# EasyEDA Pro project ProPrj_STM32F103ZET6_2025-04-15.epro, board PCB1
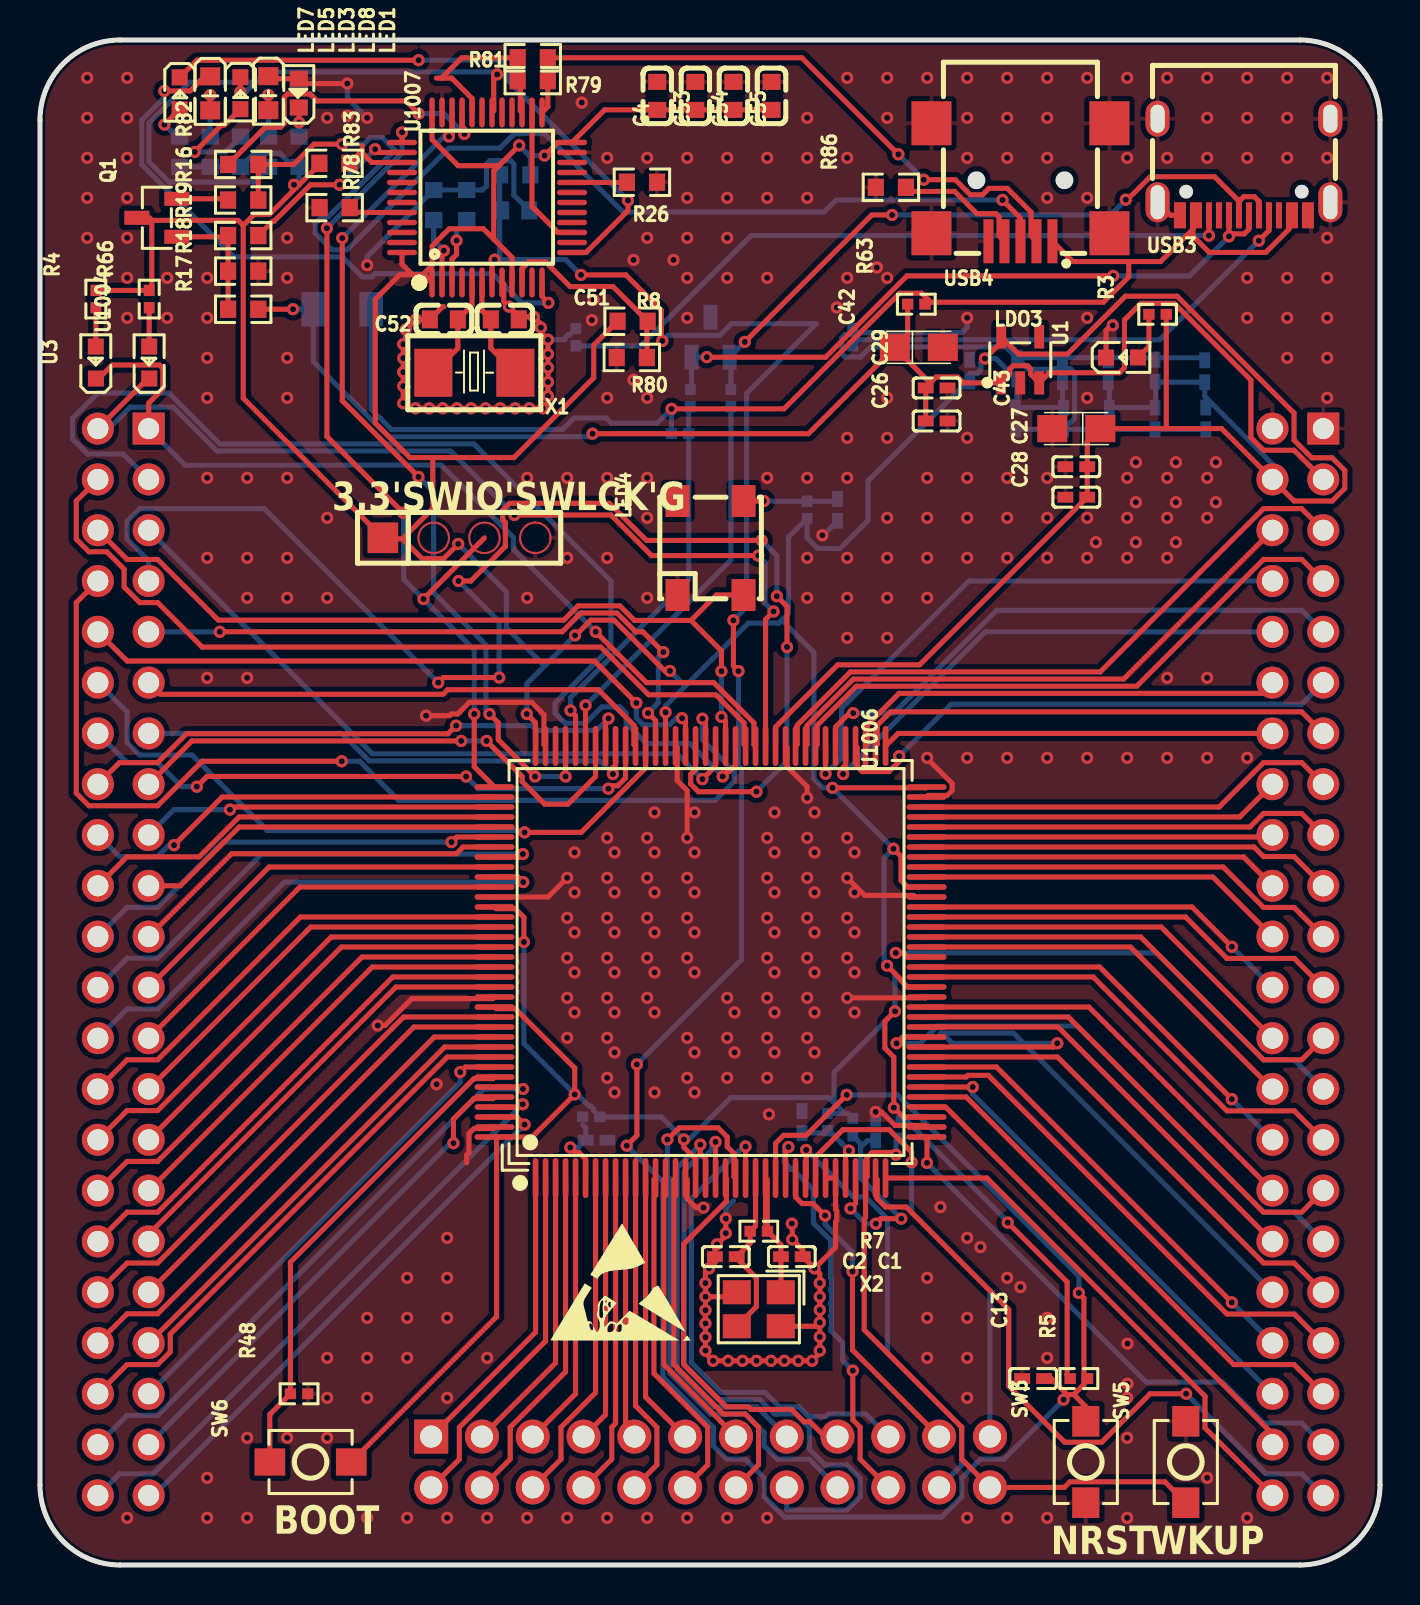
[diagram p4: board, top side]
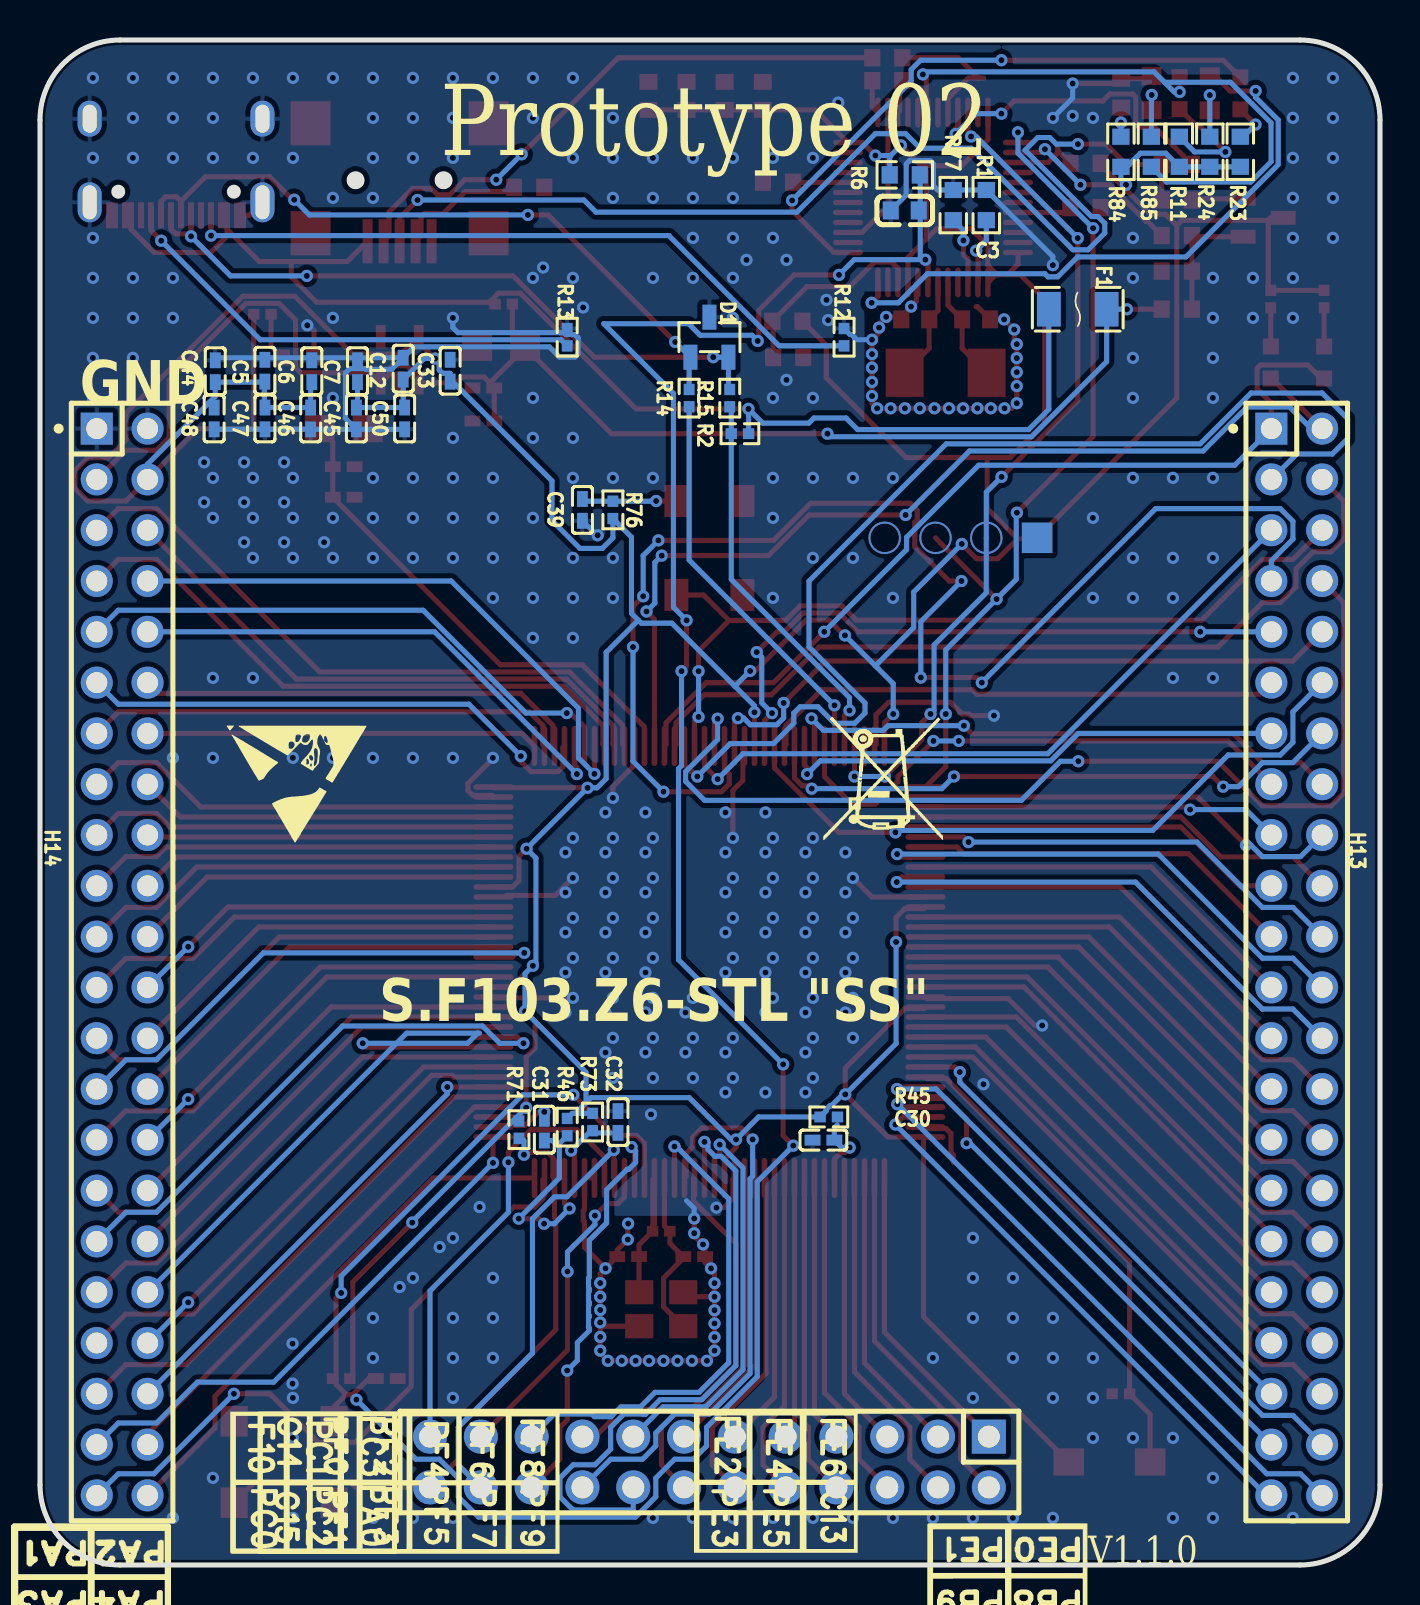
[diagram p5: board, bottom side, seen from below]

Outline 67 x 76.25 mm; copper layers: Top Layer, Bottom Layer. Coordinates in mm from the lower left corner of the outline.
Outline path: 0,72.25 0,4 arc(1.17,1.17) 4,0 63,0 arc(65.83,1.17) 67,4 67,72.25 arc(65.83,75.08) 63,76.25 4,76.25 arc(1.17,75.08) 0,72.25
Stack: Top Layer 0.035mm / Dielectric1 1.51mm FR4 er 4.5 / Bottom Layer 0.035mm

## Design rules (mm)
template: JLCPCB Capability(Two Layers Board)
spacing copperThickness1oz (default): track to track 0.102, other pairs 0.152 to 0.3
spacing copperThickness2oz: track to track 0.203, other pairs 0.152 to 0.3
track width copperThickness1oz (default): min 0.127, default 0.254, max 2.54
track width copperThickness2oz: min 0.203, default 0.254, max 2.54
differential pair differentialPair (default): width min 0.127, default 0.254, max 2.54; gap min 0.152, default 0.152
via viaSize (default): diameter min 0.5, default 0.61, max 10; hole min 0.3, default 0.305, max 6.3

## Placement (name value [footprint] x y rotation side)
C1  22pF  [C0402]  37.59 15.42 0 top
C2  22pF  [C0402]  34.29 15.42 0 top
C3  100nF  [C0603]  23.76 67.73 0 bottom
C4  100nF  [C0603]  30.86 73.46 90 top
C5  100nF  [C0402]  55.76 59.72 90 bottom
C6  100nF  [C0402]  53.41 59.69 90 bottom
C7  100nF  [C0402]  51.13 59.69 90 bottom
C12  100nF  [C0402]  48.84 59.82 90 bottom
C13  100nF  [C0402]  49.66 9.32 180 top
C26  100nF  [C0402]  44.83 57.2 0 top
C27  100nF  [C0402]  51.82 54.92 180 top
C28  100nF  [C0402]  51.82 53.39 180 top
C29  100nF  [C0402]  44.83 58.85 0 top
C30  100nF  [C0402]  27.83 21.25 0 bottom
C31  100nF  [C0402]  41.78 21.77 90 bottom
C32  100nF  [C0402]  38.1 22.15 90 bottom
C33  100nF  [C0402]  46.49 59.72 90 bottom
C39  100nF  [C0402]  39.88 52.76 270 bottom
C42  22uF  [CASE-A_3216]  43.94 60.88 0 top
C43  22uF  [CASE-A_3216]  51.82 56.82 180 top
C44  100nF  [C0402]  58.24 59.69 90 bottom
C45  100nF  [C0402]  51.18 57.33 270 bottom
C46  100nF  [C0402]  53.47 57.33 270 bottom
C47  100nF  [C0402]  55.75 57.33 270 bottom
C48  100nF  [C0402]  58.29 57.33 270 bottom
C50  100nF  [C0402]  48.77 57.33 270 bottom
C51  22pF  [C0603]  23.24 62.28 180 top
C52  22pF  [C0603]  20.19 62.28 0 top
C53  100nF  [C0603]  32.77 73.46 90 top
C54  100nF  [C0603]  34.67 73.46 90 top
C55  100nF  [C0603]  36.58 73.46 90 top
D1  ESD5302F-3/TR  [SOT-23-3_L2.9-W1.3-P1.90-LS2.4-BR]  33.53 61.39 270 bottom
F1  TLC-NSMD100  [F1206]  15.11 62.79 180 bottom
H12  PZ254V-12-24P  [HDR-TH_24P-P2.54-V-M-R2-C12-S2.54]  33.53 5.15 0 bottom
H13  X6521WV-2x22H-C60D30  [HDR-TH_44P-2.54-V-M-R2-C22-S2.54]  4.16 30.15 270 bottom
H14  X6521WV-2x22H-C60D30  [HDR-TH_44P-2.54-V-M-R2-C22-S2.54]  62.89 30.15 270 bottom
LDO3  ME6211C33M5G-N  [SOT-23-5_L3.0-W1.7-P0.95-LS2.8-BL]  49.01 60.26 0 top
LED1  19-217/BHC-ZL1M2RY/3T  [LED0603-FD_BLUE]  12.94 73.59 90 top
LED3  KT-0603R  [LED0603-RD]  10.02 73.59 270 top
LED4  WS2812E-V5  [LED-SMD_4P-L5.0-W5.0-LS5.4-TL-1]  33.53 50.85 270 top
LED5  NCD0603G1  [LED0603-RD_1]  8.51 73.58 270 top
LED7  KT-0603R  [LED0603-RD]  6.98 73.58 270 top
LED8  NCD0603G1  [LED0603-RD_1]  11.42 73.59 270 top
Q1  M8050  [SOT-23-3_L2.9-W1.3-P1.90-LS2.4-BR]  5.84 67.36 0 top
R1  10kΩ  [R0603]  19.69 68 270 bottom
R2  10kΩ  [R0402]  32 56.57 0 bottom
R3  10kΩ  [R0402]  55.88 62.54 0 top
R4  10kΩ  [R0402]  2.79 63.3 90 top
R5  10kΩ  [R0402]  51.94 9.32 180 top
R6  100kΩ  [R0603]  23.76 69.51 0 bottom
R7  10kΩ  [R0402]  35.94 16.69 180 top
R8  4.7kΩ  [R0603]  29.59 60.38 0 top
R11  1kΩ  [R0603]  10.03 70.66 90 bottom
R12  10kΩ  [R0402]  26.8 61.39 90 bottom
R13  10kΩ  [R0402]  40.64 61.39 90 bottom
R14  10kΩ  [R0402]  34.54 58.34 270 bottom
R15  10kΩ  [R0402]  32.51 58.34 270 bottom
R16  1.5kΩ  [R0603]  10.16 68.25 180 top
R17  10kΩ  [R0603]  10.16 62.79 0 top
R18  36kΩ  [R0603]  10.16 64.69 180 top
R19  100Ω  [R0603]  10.16 66.47 180 top
R23  1kΩ  [R0603]  6.98 70.66 90 bottom
R24  1kΩ  [R0603]  8.51 70.66 90 bottom
R26  10kΩ  [R0603]  30.1 69.14 180 top
R45  10kΩ  [R0402]  27.56 22.4 0 bottom
R46  10kΩ  [R0402]  40.64 21.9 270 bottom
R48  10kΩ  [R0402]  12.95 8.56 180 top
R63  10kΩ  [R0402]  43.82 63.04 0 top
R66  10kΩ  [R0402]  5.46 63.3 90 top
R71  10kΩ  [R0402]  43.05 21.77 90 bottom
R73  10kΩ  [R0402]  39.37 22.15 270 bottom
R76  10kΩ  [R0402]  38.35 52.76 90 bottom
R77  10kΩ  [R0603]  21.34 68 270 bottom
R78  10kΩ  [R0603]  14.73 67.87 180 top
R79  100Ω  [R0603]  24.64 74.22 0 top
R80  4.7kΩ  [R0603]  29.63 62.19 180 top
R81  10Ω  [R0603]  24.64 75.36 180 top
R82  10Ω  [R0603]  10.16 70.03 180 top
R83  4.7kΩ  [R0603]  14.72 70.09 0 top
R84  1kΩ  [R0603]  12.95 70.66 90 bottom
R85  1kΩ  [R0603]  11.43 70.66 90 bottom
R86  100kΩ  [R0603]  42.55 68.89 0 top
SW3  TS342A2P-WZ  [SW-SMD_L4.0-W2.9-LS5.0]  52.29 5.15 90 top
SW5  TS342A2P-WZ  [SW-SMD_L4.0-W2.9-LS5.0]  57.29 5.15 270 top
SW6  TS342A2P-WZ  [SW-SMD_L4.0-W2.9-LS5.0]  13.53 5.15 0 top
U1  -  [LED0603-RD_GREEN]  54.1 60.38 0 top
U2  -  [HDR4P]  15.88 50.09 0 top
U3  -  [LED0603-RD_GREEN]  2.79 60.12 90 top
U1004  -  [LED0603-RD_GREEN]  5.46 60.12 90 top
U1006  STM32F103ZET6  [LQFP-144_L20.0-W20.0-P0.50-LS22.0-BL]  33.53 30.15 0 top
U1007  STM32F103CBT6  [LQFP-48_L7.0-W7.0-P0.50-LS9.0-BL]  22.35 68.38 0 top
USB3  KH-TYPE-C-16P  [USB-C-SMD_KH-TYPE-C-16P]  60.2 69.9 180 top
USB4  MINI 5PTP  [MINI-USB-SMD_MINI-5PTP]  49.02 69.14 180 top
X1  8MHz  [OSC-SMD_L5.0-W3.2]  21.72 59.61 180 top
X2  8MHz  [CRYSTAL-SMD_4P-L3.2-W2.5-BL]  35.94 12.79 180 top

## Footprints (pads in the part's own frame, mm; a bottom-side part is the same pattern mirrored in y, then rotated)
C0402
  rect 0.79x0.54 smd: 1(-0.545,0) 2(0.545,0)
C0603
  rect 0.8x0.9 smd: 1(-0.7,0) 2(0.7,0)
CASE-A_3216
  rect 1.5x1.359 smd: 1(-1.2,0) 2(1.2,0)
CRYSTAL-SMD_4P-L3.2-W2.5-BL
  rect 1.4x1.2 smd: 1(-1.1,-0.85) 2(1.1,-0.85) 3(1.1,0.85) 4(-1.1,0.85)
F1206
  rect 1.19x1.728 smd: 1(-1.445,0) 2(1.445,0)
HDR4P
  custom 1.524x1.524 hole 0.914: 1(1.27,1.27) 2(3.81,1.27) 3(6.35,1.27) 4(8.89,1.27)
HDR-TH_24P-P2.54-V-M-R2-C12-S2.54
  rect 1.7x1.7 hole 1.1: 1(-13.97,-1.27)
  round 1.7 hole 1.1: 2(-13.97,1.27) 3(-11.43,-1.27) 4(-11.43,1.27) 5(-8.89,-1.27) 6(-8.89,1.27) 7(-6.35,-1.27) 8(-6.35,1.27) 9(-3.81,-1.27) 10(-3.81,1.27) 11(-1.27,-1.27) 12(-1.27,1.27) 13(1.27,-1.27) 14(1.27,1.27) 15(3.81,-1.27) 16(3.81,1.27) 17(6.35,-1.27) 18(6.35,1.27) 19(8.89,-1.27) 20(8.89,1.27) 21(11.43,-1.27) 22(11.43,1.27) 23(13.97,-1.27) 24(13.97,1.27)
HDR-TH_44P-2.54-V-M-R2-C22-S2.54
  rect 1.6x1.6 hole 1.05: 1(-26.67,-1.27)
  round 1.6 hole 1.05: 2(-26.67,1.27) 3(-24.13,-1.27) 4(-24.13,1.27) 5(-21.59,-1.27) 6(-21.59,1.27) 7(-19.05,-1.27) 8(-19.05,1.27) 9(-16.51,-1.27) 10(-16.51,1.27) 11(-13.97,-1.27) 12(-13.97,1.27) 13(-11.43,-1.27) 14(-11.43,1.27) 15(-8.89,-1.27) 16(-8.89,1.27) 17(-6.35,-1.27) 18(-6.35,1.27) 19(-3.81,-1.27) 20(-3.81,1.27) 21(-1.27,-1.27) 22(-1.27,1.27) 23(1.27,-1.27) 24(1.27,1.27) 25(3.81,-1.27) 26(3.81,1.27) 27(6.35,-1.27) 28(6.35,1.27) 29(8.89,-1.27) 30(8.89,1.27) 31(11.43,-1.27) 32(11.43,1.27) 33(13.97,-1.27) 34(13.97,1.27) 35(16.51,-1.27) 36(16.51,1.27) 37(19.05,-1.27) 38(19.05,1.27) 39(21.59,-1.27) 40(21.59,1.27) 41(24.13,-1.27) 42(24.13,1.27) 43(26.67,-1.27) 44(26.67,1.27)
LED0603-FD_BLUE
  rect 0.8x0.9 smd: 1(-0.72,0) 2(0.72,0)
LED0603-RD
  rect 0.8x0.8 smd: 1(-0.799,0) 2(0.799,0)
LED0603-RD_1
  rect 0.9x1 smd: 1(-0.85,0) 2(0.85,0)
LED0603-RD_GREEN
  rect 0.8x0.8 smd: 1(-0.8,-0.003) 2(0.8,0.003)
LED-SMD_4P-L5.0-W5.0-LS5.4-TL-1
  rect 1.6x1.2 smd: 1(-2.35,1.65) 2(-2.35,-1.65) 3(2.35,-1.65) 4(2.35,1.65)
LQFP-48_L7.0-W7.0-P0.50-LS9.0-BL
  oval 0.27x1.5 smd: 1(-2.75,-4.25) 2(-2.25,-4.25) 3(-1.75,-4.25) 4(-1.25,-4.25) 5(-0.75,-4.25) 6(-0.25,-4.25) 7(0.25,-4.25) 8(0.75,-4.25) 9(1.25,-4.25) 10(1.75,-4.25) 11(2.25,-4.25) 12(2.75,-4.25) 25(2.75,4.25) 26(2.25,4.25) 27(1.75,4.25) 28(1.25,4.25) 29(0.75,4.25) 30(0.25,4.25) 31(-0.25,4.25) 32(-0.75,4.25) 33(-1.25,4.25) 34(-1.75,4.25) 35(-2.25,4.25) 36(-2.75,4.25)
  oval 1.5x0.27 smd: 13(4.25,-2.75) 14(4.25,-2.25) 15(4.25,-1.75) 16(4.25,-1.25) 17(4.25,-0.75) 18(4.25,-0.25) 19(4.25,0.25) 20(4.25,0.75) 21(4.25,1.25) 22(4.25,1.75) 23(4.25,2.25) 24(4.25,2.75) 37(-4.25,2.75) 38(-4.25,2.25) 39(-4.25,1.75) 40(-4.25,1.25) 41(-4.25,0.75) 42(-4.25,0.25) 43(-4.25,-0.25) 44(-4.25,-0.75) 45(-4.25,-1.25) 46(-4.25,-1.75) 47(-4.25,-2.25) 48(-4.25,-2.75)
LQFP-144_L20.0-W20.0-P0.50-LS22.0-BL
  oval 0.28x2 smd: 1(-8.75,-10.8) 2(-8.25,-10.8) 3(-7.75,-10.8) 4(-7.25,-10.8) 5(-6.75,-10.8) 6(-6.25,-10.8) 7(-5.75,-10.8) 8(-5.25,-10.8) 9(-4.75,-10.8) 10(-4.25,-10.8) 11(-3.75,-10.8) 12(-3.25,-10.8) 13(-2.75,-10.8) 14(-2.25,-10.8) 15(-1.75,-10.8) 16(-1.25,-10.8) 17(-0.75,-10.8) 18(-0.25,-10.8) 19(0.25,-10.8) 20(0.75,-10.8) 21(1.25,-10.8) 22(1.75,-10.8) 23(2.25,-10.8) 24(2.75,-10.8) 25(3.25,-10.8) 26(3.75,-10.8) 27(4.25,-10.8) 28(4.75,-10.8) 29(5.25,-10.8) 30(5.75,-10.8) 31(6.25,-10.8) 32(6.75,-10.8) 33(7.25,-10.8) 34(7.75,-10.8) 35(8.25,-10.8) 36(8.75,-10.8) 73(8.75,10.8) 74(8.25,10.8) 75(7.75,10.8) 76(7.25,10.8) 77(6.75,10.8) 78(6.25,10.8) 79(5.75,10.8) 80(5.25,10.8) 81(4.75,10.8) 82(4.25,10.8) 83(3.75,10.8) 84(3.25,10.8) 85(2.75,10.8) 86(2.25,10.8) 87(1.75,10.8) 88(1.25,10.8) 89(0.75,10.8) 90(0.25,10.8) 91(-0.25,10.8) 92(-0.75,10.8) 93(-1.25,10.8) 94(-1.75,10.8) 95(-2.25,10.8) 96(-2.75,10.8) 97(-3.25,10.8) 98(-3.75,10.8) 99(-4.25,10.8) 100(-4.75,10.8) 101(-5.25,10.8) 102(-5.75,10.8) 103(-6.25,10.8) 104(-6.75,10.8) 105(-7.25,10.8) 106(-7.75,10.8) 107(-8.25,10.8) 108(-8.75,10.8)
  oval 2x0.28 smd: 37(10.8,-8.75) 38(10.8,-8.25) 39(10.8,-7.75) 40(10.8,-7.25) 41(10.8,-6.75) 42(10.8,-6.25) 43(10.8,-5.75) 44(10.8,-5.25) 45(10.8,-4.75) 46(10.8,-4.25) 47(10.8,-3.75) 48(10.8,-3.25) 49(10.8,-2.75) 50(10.8,-2.25) 51(10.8,-1.75) 52(10.8,-1.25) 53(10.8,-0.75) 54(10.8,-0.25) 55(10.8,0.25) 56(10.8,0.75) 57(10.8,1.25) 58(10.8,1.75) 59(10.8,2.25) 60(10.8,2.75) 61(10.8,3.25) 62(10.8,3.75) 63(10.8,4.25) 64(10.8,4.75) 65(10.8,5.25) 66(10.8,5.75) 67(10.8,6.25) 68(10.8,6.75) 69(10.8,7.25) 70(10.8,7.75) 71(10.8,8.25) 72(10.8,8.75) 109(-10.8,8.75) 110(-10.8,8.25) 111(-10.8,7.75) 112(-10.8,7.25) 113(-10.8,6.75) 114(-10.8,6.25) 115(-10.8,5.75) 116(-10.8,5.25) 117(-10.8,4.75) 118(-10.8,4.25) 119(-10.8,3.75) 120(-10.8,3.25) 121(-10.8,2.75) 122(-10.8,2.25) 123(-10.8,1.75) 124(-10.8,1.25) 125(-10.8,0.75) 126(-10.8,0.25) 127(-10.8,-0.25) 128(-10.8,-0.75) 129(-10.8,-1.25) 130(-10.8,-1.75) 131(-10.8,-2.25) 132(-10.8,-2.75) 133(-10.8,-3.25) 134(-10.8,-3.75) 135(-10.8,-4.25) 136(-10.8,-4.75) 137(-10.8,-5.25) 138(-10.8,-5.75) 139(-10.8,-6.25) 140(-10.8,-6.75) 141(-10.8,-7.25) 142(-10.8,-7.75) 143(-10.8,-8.25) 144(-10.8,-8.75)
MINI-USB-SMD_MINI-5PTP
  rect 0.5x2.2 smd: 1(-1.6,2.95) 2(-0.8,2.95) 3(0,2.95) 4(0.8,2.95) 5(1.6,2.95)
  rect 2x2.2 smd: 6(-4.45,2.55) 7(4.45,2.55) 8(4.45,-2.95) 9(-4.45,-2.95)
OSC-SMD_L5.0-W3.2
  rect 1.9x2.4 smd: 1(-2.05,0) 2(2.05,0)
R0402
  rect 0.566x0.54 smd: 1(-0.433,0) 2(0.433,0)
R0603
  rect 0.806x0.864 smd: 1(-0.753,0) 2(0.753,0)
SOT-23-3_L2.9-W1.3-P1.90-LS2.4-BR
  rect 1.25x0.7 smd: 1(1,-0.95) 2(1,0.95) 3(-1,0)
SOT-23-5_L3.0-W1.7-P0.95-LS2.8-BL
  rect 0.49x1.157 smd: 1(-0.95,-1.153) 2(0,-1.153) 3(0.95,-1.153)
  rect 0.49x1.175 smd: 4(0.95,1.153) 5(-0.95,1.153)
SW-SMD_L4.0-W2.9-LS5.0
  rect 1.53x1.36 smd: 1(-2.035,0) 2(2.035,0)
USB-C-SMD_KH-TYPE-C-16P
  oval 1.2x2 hole 0.7x1.7: 1(-4.32,1.765) 2(4.32,1.765)
  oval 1.2x1.8 hole 0.7x1.4: 3(-4.32,-2.415) 4(4.32,-2.415)
  rect 0.3x1.3 smd: A1(-3.35,2.415) A4(-2.55,2.415) A5(-1.25,2.415) A6(-0.25,2.415) A7(0.25,2.415) A8(1.25,2.415) A9(2.55,2.415) A12(3.35,2.415) B1(3.05,2.415) B4(2.25,2.415) B5(1.75,2.415) B6(0.75,2.415) B7(-0.75,2.415) B8(-1.75,2.415) B9(-2.25,2.415) B12(-3.05,2.415)

## Nets
As in the schematic.

Pads without a net: LDO3 4; LED4 2; U1006 106; U1007 4 11 14 16 17 19 21 22 28 29 40 41 42 43 45 46; USB3 A8 B8

## Via types
v1: diameter 0.61, hole 0.305, Top Layer to Bottom Layer, 533 vias

## Routing (per net, layer and track width the routed paths; a pad name or vN(x,y) marks a point on that pad's centre or on a via; arc(x,y) is an arc through that point)
+3.3V: length 381.1
  Top Layer w0.254: 22.69,66.29 22.17,66.81 20.46,66.81 19.61,65.96 19.61,64.99 19.13,64.52 ; 22.69,66.29 22.69,69.71 22.94,69.97 ; 22.69,66.29 23.6,65.38 U1007.9 ; 19.13,64.52 19.21,64.52 U1007.1 ; 19.13,64.52 18.63,64.52 ; 22.83,21.4 24.61,21.4 v1(26.74,23.53) 26.74,24.84 23.76,27.82 22.81,27.82 U1006.131 ; 22.83,21.4 U1006.144 ; 22.83,21.4 22.83,12.41 SW6.2 ; R80.2 27.69,61 27.69,59.36 23.7,55.37 19.64,55.37 ; C55.1 C54.1 C53.1 C4.1 28.23,72.76 U1007.24 25.88,71.13 v1(25.23,70.47) ; U1006.108 24.78,42.11 v1(24.34,42.55) ; v1(26.75,46.48) 26.78,46.48 27.54,47.24 28.7,47.24 31.24,44.7 v1(31.5,44.7) ; v1(42.36,29.96) 43.05,29.27 43.05,29.23 43.38,28.9 U1006.52 ; v1(39.62,38.86) 44.29,38.86 U1006.72 ; 12.95,69.01 v1(12.7,69.01) ; 12.95,69.01 11.48,67.54 10.72,67.54 10.16,66.98 ; 12.95,69.01 13.97,70.03 R83.1 ; 18.63,64.52 18.1,65.04 U1007.48 ; 18.63,64.52 17.99,64.52 16.76,63.29 16.76,57.11 18.5,55.37 19.64,55.37 ; 5.59,67.23 5.46,67.36 Q1.3 ; 5.59,67.23 9.91,67.23 10.16,66.98 ; 5.59,67.23 5.59,63.86 R66.2 R4.2 ; U1006.121 22.81,32.82 23.76,32.82 24.2,32.38 v1(24.2,31.15) ; R3.2 56.31,56.84 56.29,56.82 ; 22.94,69.97 v1(23.96,70.98) ; 22.94,69.97 20.91,69.97 19.6,71.28 U1007.36 ; 18.12,51.31 19.64,52.83 19.64,55.37 ; 18.12,51.31 19.11,50.32 20.18,50.32 v1(20.91,51.05) ; 18.12,51.31 17.2,51.31 10.16,58.34 10.16,66.98 ; U1006.84 36.78,41.9 39.88,45.01 43.98,45.01 C28.1 C27.1 52.36,56.17 C43.1 56.29,56.82 ; 56.29,56.82 59.08,56.82 H14.4 62.7,53.2 64.61,53.2 65.24,53.83 65.24,54.73 64.61,55.36 63.59,55.36 62.7,56.24 62.7,57.6 56.86,63.44 54.27,63.44 51.37,60.55 48.93,60.55 LDO3.5 48.06,61.14 v1(47.24,60.32) ; v1(42.75,27.69) 42.24,27.18 42.24,25.84 42.69,25.4 v1(42.69,22.87) 43.16,22.4 U1006.39 ; v1(32.2,21.27) 32.2,20.88 32.78,20.3 U1006.17 ; U1006.95 v1(31.28,42.64) ; v1(42.67,35.81) 43.05,35.44 43.05,34.23 43.38,33.9 U1006.62 ; R5.2 51.36,9.47 51.36,14.15 v1(48.39,17.12)
  Bottom Layer w0.254: v1(42.69,22.87) 48.39,17.17 v1(48.39,17.12) ; v1(12.7,69.01) 12.95,69.27 R84.1 12.66,69.91 11.98,70.59 10.72,70.59 R11.1 R24.1 R23.1 ; 55.78,59.15 C44.1 58.24,58.43 58.58,58.09 ; 55.78,59.15 C5.1 ; 55.78,59.15 55.78,57.9 C47.1 C46.1 53.47,59.09 C6.1 ; 32.26,43.94 35.41,47.09 36.93,47.09 37.08,47.24 ; 32.26,43.94 v1(31.5,44.7) ; 32.26,43.94 31.28,42.96 v1(31.28,42.64) ; 37.08,47.24 38.69,45.63 38.69,39.31 39.15,38.86 v1(39.62,38.86) v1(42.67,35.81) 42.2,35.35 42.2,30.11 v1(42.36,29.96) 42.75,29.57 v1(42.75,27.69) 39.7,24.64 39.7,23.11 ; 37.08,47.24 37.43,47.59 37.43,51.4 R76.1 38.35,51.36 38.88,50.83 40.01,50.83 41.4,52.23 41.4,54.21 46.24,59.04 ; H14.4 61.62,55.04 58.58,58.09 ; 25.23,44.96 23.32,46.87 23.32,48.65 v1(20.91,51.05) ; 25.23,44.96 v1(26.75,46.48) ; 25.23,44.96 24.34,44.07 v1(24.34,42.55) ; R73.1 40.23,22.58 ; 40.23,22.58 39.7,23.11 ; 40.23,22.58 40.39,22.58 R46.1 ; v1(24.2,31.15) 24.2,26.07 v1(26.74,23.53) 26.86,23.53 27.44,22.95 27.52,22.95 27.69,22.79 27.69,22.71 R45.2 31.07,22.4 v1(32.2,21.27) 32.44,21.27 34.54,23.37 39.45,23.37 39.7,23.11 ; R6.2 24.52,70.43 24.47,70.47 ; 24.47,70.47 v1(25.23,70.47) ; 24.47,70.47 v1(23.96,70.98) ; C7.1 51.13,57.93 C45.1 C50.1 48.84,57.94 48.84,59.27 47.79,60.32 v1(47.24,60.32) 47.04,60.12 47.04,59.75 46.88,59.59 46.51,59.59 46.49,59.57 C33.1 ; 58.58,58.09 58.36,57.87 C48.1
+5V: length 74.1
  Top Layer w0.254: 42.98,60.89 42.98,60.63 44.51,59.11 ; 42.98,60.89 C42.1 38.42,56.57 v1(27.63,56.57) ; 42.98,60.89 43.38,61.29 R63.1 ; v1(12.65,62.79) R17.2 ; C26.1 C29.1 44.51,59.11 ; 44.51,59.11 44.8,59.4 45.89,59.4 46.18,59.11 48.06,59.11 48.49,59.53 48.49,59.8 48.65,59.96 49.37,59.96 49.54,59.8 49.54,59.53 49.96,59.11 50.45,59.59 50.45,59.61 53.97,59.61 54.22,59.86 54.22,62.26 55.05,63.08 56.71,63.08 60.54,59.25 60.54,56.37 61.18,55.74 62.7,55.74 H14.3
  Bottom Layer w0.254: v1(12.65,62.79) F1.2 13.67,60.17 17.42,56.41 27.48,56.41 v1(27.63,56.57)
GND: length 164.8
  Top Layer w0.254: U1006.130 22.65,28.32 18.59,28.32 17.25,26.98 v1(16.89,26.98) ; v1(41.78,22.66) 42.07,22.66 42.75,21.98 44.25,21.98 U1006.38 ; U1006.107 25.2,41.03 25.2,42.52 24.58,43.13 21.47,43.13 20.89,42.55 20.56,42.55 20.48,42.47 v1(19.3,42.47) ; U1006.83 37.36,40.87 37.36,39.92 38.36,38.92 v1(38.36,38.36) ; v1(44.36,40.36) 44.36,40.32 45.61,39.07 45.61,38.73 45.36,38.48 44.41,38.48 U1006.71 ; U1.1 53.3,61.73 53.59,62.03 ; v1(40.36,28.36) 44.29,28.36 U1006.51 ; 43.69,33.48 41.24,33.48 v1(40.36,34.36) ; U1007.8 23.19,64.04 23.19,63.18 v1(23.45,62.92) 23.94,62.43 C51.1 24.07,62.41 v1(24.69,62.41) 25.05,62.05 v1(25.05,61.87) 25.05,61.62 v1(25.4,61.27) v1(25.4,60.55) v1(25.4,59.87) v1(25.4,59.15) v1(25.4,58.45) 25.4,58.09 v1(25.15,57.84) v1(24.47,57.84) v1(23.76,57.84) v1(23.01,57.84) v1(22.28,57.84) v1(21.55,57.84) v1(20.85,57.84) v1(20.13,57.84) v1(19.46,57.84) v1(18.78,57.84) 18.42,57.84 v1(18.16,58.09) v1(18.16,58.95) v1(18.16,59.64) v1(18.16,60.34) v1(18.16,61.04) 18.29,61.17 v1(18.29,61.77) v1(18.8,62.28) C52.1 20.13,62.92 20.19,62.92 ; v1(15.37,74.07) 13.18,74.07 LED1.2 11.55,74.31 LED8.1 ; v1(33.27,13.41) v1(33.27,14.09) 33.27,14.66 v1(33.45,14.83) 33.75,15.13 C2.1 33.75,15.93 v1(33.85,16.03) 34.29,16.47 v1(34.29,16.59) v1(34.29,17.32) ; v1(33.27,13.41) v1(33.27,12.74) v1(33.27,12.08) v1(33.27,11.39) v1(33.27,10.72) 33.27,10.59 v1(33.66,10.21) v1(34.4,10.21) v1(35.13,10.21) v1(35.83,10.21) v1(36.55,10.21) v1(37.22,10.21) v1(37.91,10.21) v1(38.61,10.21) 38.99,10.59 v1(38.99,10.72) v1(38.99,11.4) v1(38.99,12.13) ; v1(33.27,13.41) 34.61,13.41 34.84,13.64 ; v1(37.59,17.07) 37.61,17.05 v1(37.61,16.28) 38.14,15.75 C1.2 v1(38.73,14.83) ; v1(33.18,17.87) 32.81,17.87 32.36,18.32 32.36,19.27 U1006.16 ; U1006.94 31.86,40.87 31.86,39.22 32.36,38.73 v1(32.36,36.36) ; USB3.B1 USB3.A12 56.53,67.49 USB3.2 ; v1(38.73,14.83) 39.78,15.88 39.78,17.17 39.84,17.23 39.84,17.71 39.78,17.77 U1006.31 U1006.30 ; v1(38.73,14.83) 38.99,14.57 v1(38.99,14.1) v1(38.99,13.41) v1(38.99,12.75) v1(38.99,12.13) ; U1006.120 25.4,33.4 v1(26.36,34.36) ; 21.34,20.12 21.34,20.51 21.45,20.62 21.45,21.57 21.69,21.82 22.65,21.82 U1006.143 ; v1(38.99,12.13) 38.8,11.94 X2.4
  Bottom Layer w0.254: R12.2 26.49,61.52 26.41,61.52 26.25,61.36 26.25,61.28 26.24,61.27 v1(25.4,61.27) ; v1(34.29,17.32) 34.29,17.83 34.67,18.21 ; v1(16.36,72.36) 15.37,73.35 v1(15.37,74.07) ; v1(16.36,64.99) 16.36,65.42 R1.1 R77.1 22.12,68.75 22.33,68.96 22.33,70.05 22.49,70.22 23.53,70.22 23.69,70.05 23.69,68.5 C3.2 ; 48.84,60.36 58.11,60.36 C44.2 ; 48.84,60.36 48.3,60.91 41.54,60.91 41.03,60.4 40.25,60.4 40.09,60.56 40.09,61.36 40.25,61.52 40.7,61.52 40.8,61.62 46.1,61.62 46.36,61.87 v1(46.36,62.36) ; 48.84,60.36 49.42,59.78 50.7,59.78 50.74,59.82 51.51,59.82 51.73,59.6 51.73,57.33 C45.2 ; C39.2 39.15,51.49 v1(39.12,51.49) ; C50.2 C45.2 ; C45.2 C46.2 C47.2 C48.2
  vias: v1(2.36,74.36) v1(2.36,72.36) v1(2.36,70.36) v1(2.36,68.36) v1(2.36,66.36) v1(4.36,74.36) v1(4.36,72.36) v1(4.36,70.36) v1(4.36,68.36) v1(4.36,66.36) v1(4.36,64.36) v1(4.36,62.36) v1(4.36,2.36) v1(6.36,64.36) v1(6.36,62.36) v1(8.36,64.36) v1(8.36,62.36) v1(8.36,60.36) v1(8.36,58.36) v1(8.36,54.36) v1(8.36,50.36) v1(8.36,44.36) v1(8.36,4.36) v1(8.36,2.36) v1(10.36,54.36) v1(10.36,50.36) v1(10.36,48.36) v1(10.36,44.36) v1(10.36,6.36) v1(10.36,2.36) v1(12.36,66.36) v1(12.36,64.36) v1(12.36,60.36) v1(12.36,58.36) v1(12.36,54.36) v1(12.36,50.36) v1(12.36,48.36) v1(12.36,6.36) v1(14.36,72.36) v1(14.36,52.36) v1(14.36,48.36) v1(14.36,10.36) v1(14.36,8.36) v1(14.36,6.36) v1(15.37,72.46) v1(16.36,12.36) v1(16.36,10.36) v1(16.36,8.36) v1(16.36,2.36) v1(18.36,14.36) v1(18.36,12.36) v1(18.36,10.36) v1(18.36,2.36) v1(19.83,24.04) v1(20.36,16.36) v1(20.36,14.36) v1(20.36,12.36) v1(20.36,8.36) v1(20.36,2.36) v1(22.36,10.36) v1(22.36,2.36) v1(24.36,54.36) v1(24.36,48.36) v1(24.36,2.36) v1(26.36,54.36) v1(26.36,50.36) v1(26.36,32.36) v1(26.36,30.36) v1(26.36,28.36) v1(26.36,26.36) v1(26.36,2.36) v1(26.73,35.63) v1(26.73,33.63) v1(26.73,31.63) v1(26.73,29.63) v1(26.73,27.63) v1(27.09,73.12) v1(27.68,63.26) v1(27.6,62.25) v1(28.36,70.36) v1(28.36,58.36) v1(28.36,54.36) v1(28.36,50.36) v1(28.36,36.36) v1(28.36,34.36) v1(28.36,32.36) v1(28.36,30.36) v1(28.36,28.36) v1(28.36,26.36) v1(28.36,24.36) v1(28.36,2.36) v1(28.73,35.63) v1(28.73,33.63) v1(28.73,31.63) v1(28.73,29.63) v1(28.73,27.63) v1(28.73,25.63) v1(28.73,23.63) v1(29.68,65.26) v1(29.68,59.26) v1(30.36,70.36) v1(30.36,66.36) v1(30.36,58.36) v1(30.36,54.36) v1(30.36,52.36) v1(30.36,48.36) v1(30.36,36.36) v1(30.36,34.36) v1(30.36,32.36) v1(30.36,30.36) v1(30.36,28.36) v1(30.36,2.36) v1(30.73,37.63) v1(30.73,35.63) v1(30.73,33.63) v1(30.73,31.63) v1(30.73,29.63) v1(30.73,27.63) v1(30.73,23.63) v1(31.68,65.26) v1(32.36,70.36) v1(32.36,68.36) v1(32.36,66.36) v1(32.36,64.36) v1(32.36,62.36) v1(32.36,34.36) v1(32.36,32.36) v1(32.36,30.36) v1(32.36,26.36) v1(32.36,24.36) v1(32.36,2.36) v1(32.73,37.63) v1(32.73,35.63) v1(32.73,33.63) v1(32.73,31.63) v1(32.73,29.63) v1(32.73,25.63) v1(32.73,23.63) v1(34.36,70.36) v1(34.36,68.36) v1(34.36,66.36) v1(34.36,64.36) v1(34.36,28.36) v1(34.36,26.36) v1(34.36,24.36) v1(34.36,2.36) v1(34.73,27.63) v1(34.73,25.63) v1(36.36,70.36) v1(36.36,68.36) v1(36.36,64.36) v1(36.36,54.36) v1(36.36,36.36) v1(36.36,34.36) v1(36.36,32.36) v1(36.36,30.36) v1(36.36,28.36) v1(36.36,26.36) v1(36.36,24.36) v1(36.36,2.36) v1(36.45,22.53) v1(36.73,37.63) v1(36.73,35.63) v1(36.73,33.63) v1(36.73,31.63) v1(36.73,29.63) v1(36.73,27.63) v1(36.73,25.63) v1(38.36,72.36) v1(38.36,70.36) v1(38.36,68.36) v1(38.36,54.36) v1(38.36,50.36) v1(38.36,48.36) v1(38.36,36.36) v1(38.36,34.36) v1(38.36,32.36) v1(38.36,30.36) v1(38.36,28.36) v1(38.36,26.36) v1(38.36,24.36) v1(38.73,37.63) v1(38.73,35.63) v1(38.73,33.63) v1(38.73,31.63) v1(38.73,29.63) v1(38.73,27.63) v1(38.73,25.63) v1(39.84,62.88) v1(40.36,74.36) v1(40.36,70.36) v1(40.36,64.36) v1(40.36,56.36) v1(40.36,54.36) v1(40.36,50.36) v1(40.36,48.36) v1(40.36,46.36) v1(40.36,36.36) v1(40.36,32.36) v1(40.36,30.36) v1(40.73,35.63) v1(40.73,33.63) v1(40.73,31.63) v1(40.73,29.63) v1(40.73,27.63) v1(41.84,64.88) v1(42.36,74.36) v1(42.36,72.36) v1(42.36,64.36) v1(42.36,58.36) v1(42.36,56.36) v1(42.36,52.36) v1(42.36,50.36) v1(42.36,48.36) v1(42.36,46.36) v1(44.36,74.36) v1(44.36,54.36) v1(44.36,52.36) v1(44.36,50.36) v1(44.36,48.36) v1(44.36,14.36) v1(44.36,12.36) v1(44.36,10.36) v1(45.02,17.9) v1(46.36,74.36) v1(46.36,72.36) v1(46.36,70.36) v1(46.36,56.36) v1(46.36,54.36) v1(46.36,52.36) v1(46.36,50.36) v1(46.36,40.36) v1(46.36,16.36) v1(46.36,12.36) v1(46.36,10.36) v1(46.36,8.36) v1(46.36,2.36) v1(47.02,15.9) v1(48.36,74.36) v1(48.36,72.36) v1(48.36,70.36) v1(48.36,54.36) v1(48.36,52.36) v1(48.36,50.36) v1(48.36,40.36) v1(48.36,14.36) v1(48.36,2.36) v1(49.02,13.9) v1(50.36,74.36) v1(50.36,72.36) v1(50.36,70.36) v1(50.36,68.36) v1(50.36,54.36) v1(50.36,52.36) v1(50.36,50.36) v1(50.36,40.36) v1(50.36,12.36) v1(50.36,10.36) v1(50.36,2.36) v1(52.36,74.36) v1(52.36,68.36) v1(52.36,62.36) v1(52.36,58.36) v1(52.36,52.36) v1(52.36,50.36) v1(52.36,40.36) v1(52.79,51.14) v1(53.64,61.98) v1(54.36,74.36) v1(54.36,70.36) v1(54.36,54.36) v1(54.36,52.36) v1(54.36,50.36) v1(54.36,40.36) v1(54.37,11.07) v1(54.37,9.07) v1(54.36,8.36) v1(54.36,6.36) v1(54.36,2.36) v1(54.79,55.14) v1(54.79,53.14) v1(54.79,51.14) v1(56.36,74.36) v1(56.36,70.36) v1(56.36,54.36) v1(56.36,52.36) v1(56.36,50.36) v1(56.36,44.36) v1(56.36,40.36) v1(56.79,55.14) v1(56.79,53.14) v1(56.79,51.14) v1(58.36,74.36) v1(58.36,72.36) v1(58.36,70.36) v1(58.36,54.36) v1(58.36,52.36) v1(58.36,44.36) v1(58.36,40.36) v1(58.36,4.36) v1(58.79,55.14) v1(58.79,53.14) v1(60.36,74.36) v1(60.36,72.36) v1(60.36,70.36) v1(60.36,64.36) v1(60.36,62.36) v1(60.36,40.36) v1(60.36,2.36) v1(62.36,74.36) v1(62.36,72.36) v1(62.36,70.36) v1(62.36,64.36) v1(62.36,62.36) v1(62.36,60.36) v1(64.36,74.36) v1(64.36,70.36) v1(64.36,66.36) v1(64.36,64.36) v1(64.36,62.36) v1(64.36,60.36) v1(64.36,58.36)
VBAT: length 3.7
  Top Layer w0.254: v1(26.52,20.87) 26.76,20.63 26.95,20.63 27.28,20.3 U1006.6
  Bottom Layer w0.254: 27.14,22.01 27.28,21.87 27.28,21.25 26.91,20.87 v1(26.52,20.87)
VBUS: length 65.4
  Top Layer w0.254: USB3.A4 USB3.B9 62.45,66.79 61.29,65.63 58.46,65.63 57.65,66.44 57.65,66.79 ; 44.53,63.14 44.43,63.04 R63.2 ; 44.53,63.14 53.17,63.14 54.44,64.41 54.44,65.17 ; 44.53,63.14 44.08,63.59 42.98,63.59 37.2,57.81 v1(31.58,57.81) ; 54.44,65.17 56.03,65.17 57.65,66.79 ; 54.44,65.17 51.64,65.17 USB4.1 ; USB3.B4 USB3.A9 57.65,66.79
  Bottom Layer w0.254: 31.57,57.8 30.87,57.1 28.56,57.1 28.31,57.35 26.7,57.35 26.12,56.77 17.57,56.77 16.56,57.78 F1.1 ; 31.57,57.8 v1(31.58,57.81) ; 31.57,57.8 R2.1
VDDA: length 10.4
  Top Layer w0.254: v1(41.79,17.06) 42.05,17.32 v1(43.06,17.32) ; v1(40.52,17.83) 40.78,18.08 U1006.33
  Bottom Layer w0.254: 41.03,20.87 41.03,19.35 v1(43.06,17.32) ; 41.03,20.87 41.03,21.07 R46.2 ; 41.03,20.87 41.38,21.22 41.53,21.22 ; v1(41.79,17.06) 41.29,17.06 v1(40.52,17.83)
AIN: length 10.2
  Top Layer w0.254: U1007.10 24.1,64.83 24.43,65.16 25.27,65.16 26.51,63.92 28.65,63.92 R80.1 30.34,62.15 R8.2
BOOT0: length 24.5
  Top Layer w0.254: U1006.138 22.65,24.32 21.69,24.32 12.52,15.15 R48.2 11.49,7.53 SW6.1
CC1: length 24
  Top Layer w0.254: v1(60.94,66.22) 61.45,66.72 USB3.A5
  Bottom Layer w0.254: v1(60.94,66.22) 55.99,61.26 40.94,61.26 R13.1
CC2: length 34.9
  Top Layer w0.254: v1(58.45,66.47) USB3.B5
  Bottom Layer w0.254: R12.1 30.04,60.96 35.56,66.47 v1(58.45,66.47)
D+: length 56.8
  Top Layer w0.254: R16.1 R82.1 12.68,70.03 13.7,71.04 v1(15.1,71.04) ; v1(48.12,68.25) 49.02,67.35 USB4.3
  Bottom Layer w0.254: v1(15.1,71.04) 16.18,71.04 16.51,71.37 17.12,71.37 17.75,70.74 14.43,67.42 14.1,67.42 13.76,67.08 13.76,66.6 14.6,65.76 15.36,65.76 20.44,70.84 22.99,70.84 23.72,71.57 25.23,71.57 29.15,67.64 39.2,67.64 39.81,68.25 v1(48.12,68.25)
D-: length 29.2
  Top Layer w0.254: USB4.2 49.55,66.46 49.55,67.65 48.37,68.83 47.45,68.83 47.12,68.51 46.52,68.51 45.76,69.27 v1(44.19,69.27) ; R81.1 38.09,75.36 v1(42.92,70.54)
  Bottom Layer w0.254: v1(44.19,69.27) v1(42.92,70.54)
DN: length 34
  Top Layer w0.254: v1(35.24,61.15) 41.59,67.5 v1(42.61,67.5) ; v1(54.29,68.27) 54.36,68.27 55.51,69.42 58.73,69.42 59.88,68.27 ; USB3.A7 59.95,68.2 59.88,68.27 ; USB3.B7 60.95,68.18 60.71,68.42 60.18,68.42 60.03,68.27 59.88,68.27
  Bottom Layer w0.254: v1(42.61,67.5) 53.53,67.5 v1(54.29,68.27) ; R14.1 34.54,60.33 D1.1 v1(35.24,61.15)
DP: length 33.8
  Top Layer w0.254: v1(53.66,64.46) 43.34,64.46 39.28,60.39 v1(33.34,60.39) ; USB3.B6 v1(59.45,66.43) 59.57,66.56 60.21,66.56 60.45,66.79 USB3.A6
  Bottom Layer w0.254: v1(33.34,60.39) D1.2 32.58,58.97 32.51,58.9 ; v1(59.45,66.43) 57.47,64.46 v1(53.66,64.46)
LED_STLINK: length 30.9
  Top Layer w0.254: v1(10.02,73.65) 10.02,74.39 ; v1(22.86,74.53) 22.69,74.36 22.69,72.71 U1007.30
  Bottom Layer w0.254: 10.78,74.14 11.29,74.66 22.73,74.66 v1(22.86,74.53) ; 10.78,74.14 7.48,74.14 5.45,72.11 5.45,70.16 6.46,69.15 10.67,69.15 R85.1 ; 10.78,74.14 10.29,73.65 v1(10.02,73.65)
NRST: length 141
  Top Layer w0.254: v1(31.11,61.2) 31.07,61.25 31.07,62.73 29.3,64.51 v1(27.05,64.51) ; 51.69,8.52 52.29,7.92 SW3.2 ; 51.69,8.52 52.2,9.03 52.2,9.28 ; 51.69,8.52 51.43,8.52 ; 51.43,8.52 51.36,8.52 50.56,9.32 C13.1 ; 51.43,8.52 v1(51.18,8.27) ; v1(29.34,20.97) 29.84,21.48 v1(29.84,25.03) ; U1007.7 22.6,65.14 v1(22.73,65.27) ; 52.2,9.28 52.23,9.32 R5.1 ; 52.2,9.28 52.2,13.35 v1(51.94,13.6) ; v1(34.67,47.23) 34.67,44.95 v1(34.92,44.69) ; v1(40.33,23.51) 38.31,21.48 37.18,21.48 36.78,21.08 U1006.25
  Bottom Layer w0.254: v1(34.92,44.69) 34.92,39.97 35.08,39.82 35.08,30.26 v1(29.84,25.03) ; v1(51.18,8.27) 48.2,5.29 47.03,5.29 46.09,4.35 46.09,3.41 45.07,2.4 37.23,2.4 36.21,3.41 36.21,4.35 35.27,5.29 34.33,5.29 33.67,5.95 33.67,6.89 31.14,9.42 31.14,19.16 v1(29.34,20.97) ; 22.99,65.27 22.99,69.48 R6.1 ; 22.99,65.27 26.29,65.27 v1(27.05,64.51) ; 22.99,65.27 v1(22.73,65.27) ; v1(31.11,61.2) 31.4,61.49 33.99,61.49 34.57,62.06 38.81,62.06 35.33,58.58 35.33,47.89 v1(34.67,47.23) ; v1(51.94,13.6) 51.94,14.44 42.87,23.51 v1(40.33,23.51)
OS_IN: length 5.7
  Top Layer w0.254: 19.67,60 19.75,60.08 19.75,59.82 ; U1007.5 21.6,62.99 C52.2 20.89,60.84 19.67,59.61
OS_OUT: length 5.2
  Top Layer w0.254: U1007.6 22.1,62.72 C51.2 22.54,60.84 X1.1
OSC_IN: length 8.6
  Top Layer w0.254: 34.88,15.46 34.88,15.29 35.82,14.35 35.82,12.92 34.84,11.94 ; 34.88,15.46 35.51,16.09 R7.2 35.78,16.96 U1006.23 ; 34.88,15.46 C2.2
OSC_OUT: length 8.7
  Top Layer w0.254: 37.05,13.89 C1.1 37.05,16.02 R7.1 36.37,16.97 36.36,16.98 ; 37.05,13.89 X2.1 37.05,13.64 37.05,13.89 ; 36.36,16.98 36.36,19.27 U1006.24 36.28,17.06 36.36,16.98
PA0-WKUP: length 32
  Top Layer w0.254: SW5.2 56.25,4.16 51.49,4.16 51.22,3.88 H12.24 46.09,5.29 46.09,6.89 41.21,11.76 41.21,17.31 41.28,17.37 U1006.34 41.36,19.43 41.36,20.38 41.6,20.63 42.69,20.63 v1(42.8,20.51)
  Bottom Layer w0.254: v1(42.8,20.51) 42.8,21.21 42.93,21.34
PA1: length 33.8
  Top Layer w0.254: U1006.35 41.86,19.27 41.86,18.32 42.27,17.9 43.31,17.9 48.44,12.77 48.44,8.94 51.23,6.14 53.09,6.14 55.5,8.56 v1(57.3,8.56)
  Bottom Layer w0.254: v1(57.3,8.56) 61.31,4.56 63.08,4.56 H14.43
PA2: length 26.8
  Top Layer w0.254: U1006.36 47.34,19.35 58.25,8.44 58.25,6.85 H14.44
PA3: length 26.9
  Top Layer w0.254: v1(44.35,20.11) 44.35,21.38 U1006.37
  Bottom Layer w0.254: H14.41 63.08,7.1 61.18,7.1 59.13,9.14 55.31,9.14 v1(44.35,20.11)
PA4: length 24.6
  Top Layer w0.254: U1006.40 45.28,22.9 61.62,6.56 H14.42
PA5: length 26
  Top Layer w0.254: H14.39 62.7,10.02 59.69,10.02 46.31,23.4 U1006.41
PA6: length 23.9
  Top Layer w0.254: U1006.42 v1(46.64,23.9)
  Bottom Layer w0.254: v1(46.64,23.9) 46.64,23.55 H14.40
PA7: length 25.4
  Top Layer w0.254: U1006.43 46.31,24.4 46.39,24.48 47.41,24.48 59.35,12.55 62.72,12.55 H14.37
PA8: length 25.5
  Top Layer w0.254: v1(28.65,39.55) 28.65,39.87 28.78,40 U1006.100
  Bottom Layer w0.254: v1(28.65,39.55) 27.99,40.21 16.46,40.21 15.09,41.58 H13.13
PA9: length 28.5
  Top Layer w0.254: v1(28.42,42.33) 28.28,42.18 U1006.101 ; 2.89,39.04 3.97,40.12 5.88,40.12 7.32,41.56 20.4,41.56 v1(20.8,41.97)
  Bottom Layer w0.254: v1(20.8,41.97) 24.6,41.97 24.83,41.73 27.83,41.73 v1(28.42,42.33)
PA10: length 26.8
  Top Layer w0.254: U1006.102 27.78,39.43 26.39,38.04 25.24,38.04 24.11,39.17 24.11,39.43 v1(22.33,41.2) ; v1(21.06,41.2) 7.6,41.2 H13.15
  Bottom Layer w0.254: v1(22.33,41.2) v1(21.06,41.2)
PA11/USB_DM: length 20
  Top Layer w0.254: U1006.103 v1(27.28,42.98)
  Bottom Layer w0.254: v1(27.28,42.98) 34.54,50.25 R14.2
PA12/USB_DP: length 19.7
  Top Layer w0.254: v1(26.52,42.73) 26.78,42.47 U1006.104
  Bottom Layer w0.254: v1(26.52,42.73) 26.52,43.37 32.44,49.28 R2.2 32.44,57.84 R15.2 32.51,58.04
PA13-SWIO: length 42.7
  Top Layer w0.254: v1(18.92,54.41) 15.11,58.22 v1(15.11,66.34) ; v1(24.75,39.43) 22.91,41.27 22.91,42.11 v1(22.47,42.55) ; v1(20.45,71.43) 20.6,71.58 U1007.34 ; v1(26.28,39.43) U1006.105
  Bottom Layer w0.254: v1(22.47,42.55) 22.3,42.73 22.3,46 19.69,48.61 U2.2 19.69,53.65 v1(18.92,54.41) ; v1(20.45,71.43) 20.19,71.43 v1(15.11,66.34) ; v1(24.75,39.43) v1(26.28,39.43)
PA14-SWCK: length 42.6
  Top Layer w0.254: v1(21.71,42.55) 21.71,39.92 U1006.109 ; v1(14.35,66.84) 14.35,56.43 v1(18.16,52.62) ; U1007.37 v1(18.1,71.64) ; v1(19.17,48.3) U2.3
  Bottom Layer w0.254: v1(18.16,52.62) 18.19,52.59 18.19,49.28 v1(19.17,48.3) 21.71,45.76 v1(21.71,42.55) ; v1(14.35,66.84) 18.1,70.6 v1(18.1,71.64)
PA15: length 21.5
  Top Layer w0.254: U1006.110 9.11,38.4 v1(6.7,35.99)
  Bottom Layer w0.254: 2.89,36.5 3.97,35.42 5.88,35.42 6.45,35.99 v1(6.7,35.99)
PB0: length 34.5
  Top Layer w0.254: v1(50.86,26.09) 50.68,25.9 U1006.46
  Bottom Layer w0.254: 49.18,26.09 45.62,26.09 45.11,26.59 ; 49.18,26.09 48.67,26.59 45.11,26.59 ; 49.18,26.09 H14.36 ; 49.18,26.09 v1(50.86,26.09) ; 45.11,26.59 45.02,26.59
PB1: length 27.8
  Top Layer w0.254: v1(42.83,26.09) 43.14,26.4 U1006.47
  Bottom Layer w0.254: H14.33 62.7,17.64 61.18,17.64 51.87,26.95 44.87,26.95 44.01,26.09 v1(42.83,26.09)
PB2: length 21.7
  Top Layer w0.254: H14.34 50.9,26.9 U1006.48
PB3: length 22.8
  Top Layer w0.254: H13.35 18.69,26.9 U1006.133
PB4: length 26.2
  Top Layer w0.254: 2.89,11.1 4.35,12.56 5.88,12.56 19.72,26.4 U1006.134
PB5: length 23.4
  Top Layer w0.254: U1006.135 20.23,25.9 H13.37
PB6: length 27.3
  Top Layer w0.254: U1006.136 20.36,25.4 6.51,11.55 6.51,10.65 5.88,10.02 4.35,10.02 2.89,8.56
PB7: length 24.4
  Top Layer w0.254: v1(21.01,24.65) 21.27,24.9 U1006.137
  Bottom Layer w0.254: v1(21.01,24.65) 21.01,24.14 H13.39
PB8: length 30.1
  Top Layer w0.254: U1006.139 24.05,23.9 v1(24.15,23.8)
  Bottom Layer w0.254: v1(24.15,23.8) 22.2,23.8 5.88,7.48 4.35,7.48 2.89,6.02
PB9: length 25.2
  Top Layer w0.254: v1(20.67,21.09) 20.67,22.3 21.69,23.32 22.65,23.32 U1006.140
  Bottom Layer w0.254: v1(20.67,21.09) 20.5,21.09 H13.41
PB10: length 18
  Top Layer w0.254: U1006.69 59.98,37.4 H14.16
PB11: length 21.2
  Top Layer w0.254: U1006.70 58.96,37.9 61.18,40.12 63.08,40.12 H14.15
PB12: length 19.6
  Top Layer w0.254: U1006.73 42.91,41.58 H14.14
PB13: length 24.1
  Top Layer w0.254: H14.13 63.08,42.66 42.53,42.66 41.86,41.98 41.86,41.03 U1006.74
PB14: length 22.2
  Top Layer w0.254: U1006.75 41.36,41.03 41.36,41.99 42.96,43.59 61.09,43.59 H14.12
PB15: length 26.5
  Top Layer w0.254: v1(42.96,40.44) 42.96,40.18 42.45,39.67 41.1,39.67 40.86,39.92 40.86,40.87 U1006.76
  Bottom Layer w0.254: v1(42.96,40.44) 45.56,43.04 63.08,43.04 H14.11
PC0: length 21
  Top Layer w0.254: U1006.26 37.28,20.76 v1(37.42,20.9) ; v1(40.64,9.72) 40.64,7.25 41.01,6.89 41.01,5.29 H12.20
  Bottom Layer w0.254: v1(37.42,20.9) 37.22,20.69 37.22,20.13 37.56,19.79 37.64,19.79 38.67,18.76 38.67,17.1 39.53,16.24 39.53,14.38 39.57,14.34 39.57,13.86 39.53,13.82 39.53,13.69 39.57,13.65 39.57,13.17 39.53,13.13 39.53,13.03 39.57,12.99 39.57,12.51 39.53,12.47 39.53,12.41 39.57,12.37 39.57,11.89 39.53,11.85 39.53,11.72 40.13,11.12 40.13,10.23 v1(40.64,9.72)
PC1: length 16.2
  Top Layer w0.254: U1006.27 37.78,18.4 38.1,18.07 38.65,18.07 v1(39.25,17.47) ; v1(40.63,14.68) 40.63,10.75 H12.21
  Bottom Layer w0.254: v1(39.25,17.47) 39.25,17.02 40.63,15.65 v1(40.63,14.68)
PC2: length 22.3
  Top Layer w0.254: U1006.28 38.31,19.38 v1(38.31,20.75)
  Bottom Layer w0.254: v1(38.31,20.75) 40.65,18.41 41.27,18.41 42.38,17.31 42.38,10.6 46.09,6.89 46.09,5.01 H12.22
PC3: length 22.7
  Top Layer w0.254: U1006.29 38.78,20.4 40.15,21.77 42.46,21.77 43.58,20.64 v1(43.58,20.14)
  Bottom Layer w0.254: v1(43.58,20.14) 43.58,17.63 47.5,13.71 H12.23
PC4: length 23
  Top Layer w0.254: U1006.44 47.82,24.9 v1(59.59,13.13)
  Bottom Layer w0.254: v1(59.59,13.13) H14.38
PC5: length 24.7
  Top Layer w0.254: H14.35 62.7,15.1 61.18,15.1 50.88,25.4 U1006.45
PC6: length 32.1
  Top Layer w0.254: v1(31.16,45.64) 30.15,46.66 29.79,46.66 28.85,47.6 27.05,47.6 26.11,46.66 v1(8.99,46.66) ; U1006.96 30.78,42.22 v1(30.4,42.6)
  Bottom Layer w0.254: v1(31.16,45.64) 30.91,45.39 30.91,43.11 v1(30.4,42.6) ; v1(8.99,46.66) H13.9
PC7: length 33.8
  Top Layer w0.254: v1(24.23,36.63) 27.06,36.63 30.28,39.85 U1006.97
  Bottom Layer w0.254: v1(24.23,36.63) 24.13,36.73 11.36,36.73 7.59,40.5 4.99,40.5 4.35,41.13 4.35,42.66 2.89,44.12
PC8: length 26.4
  Top Layer w0.254: U1006.98 29.7,41.03 29.7,41.98 27.92,43.76 20.38,43.76 20.15,43.54 6.02,43.54 H13.11
PC9: length 29.8
  Top Layer w0.254: U1006.99 29.28,39.35 28.89,38.96 28.56,38.96 v1(28.42,38.82) ; v1(7.84,38.92) 8.35,39.43 v1(21.3,39.43)
  Bottom Layer w0.254: v1(28.42,38.82) 21.91,38.82 v1(21.3,39.43) ; 2.89,41.58 4.35,40.12 5.88,40.12 7.08,38.92 v1(7.84,38.92)
PC10: length 17.9
  Top Layer w0.254: U1006.111 9.63,37.9 v1(9.5,37.77)
  Bottom Layer w0.254: H13.17 6.7,37.77 v1(9.5,37.77)
PC11: length 21.3
  Top Layer w0.254: 2.89,33.96 4.34,35.41 7.96,35.41 9.95,37.4 U1006.112
PC12: length 18.5
  Top Layer w0.254: H13.19 7.02,33.96 9.96,36.9 U1006.113
PC13-TAMPER-RTC: length 16.8
  Top Layer w0.254: H12.6 26.05,5.29 26.05,6.89 27.78,8.62 U1006.7
PC14-OSC32_IN: length 13.4
  Top Layer w0.254: U1006.8 28.28,7.52 H12.7
PC15-OSC32_OUT: length 16.1
  Top Layer w0.254: H12.8 28.59,5.29 28.59,6.89 28.78,7.08 U1006.9
PD0: length 21.9
  Top Layer w0.254: U1006.114 20.83,36.4 v1(20.57,36.15)
  Bottom Layer w0.254: 2.89,31.42 4.35,32.88 5.88,32.88 9.15,36.15 v1(20.57,36.15)
PD1: length 19.2
  Top Layer w0.254: H13.21 9.58,35.56 20.82,35.56 21.15,35.9 U1006.115
PD2: length 25.5
  Top Layer w0.254: U1006.116 24,35.4 v1(24.14,35.55)
  Bottom Layer w0.254: 2.89,28.88 4.35,30.34 5.88,30.34 11.09,35.55 v1(24.14,35.55)
PD3: length 19.8
  Top Layer w0.254: H13.23 11.45,34.9 U1006.117
PD4: length 26
  Top Layer w0.254: v1(24.16,34.15) 23.91,34.4 U1006.118
  Bottom Layer w0.254: v1(24.16,34.15) 12.23,34.15 5.88,27.8 4.35,27.8 2.89,26.34
PD5: length 20.4
  Top Layer w0.254: H13.25 12.99,33.9 U1006.119
PD6: length 23.4
  Top Layer w0.254: U1006.122 13.02,32.4 5.88,25.26 4.35,25.26 2.89,23.8
PD7: length 20.7
  Top Layer w0.254: U1006.123 13.53,31.9 H13.27
PD8: length 25.9
  Top Layer w0.254: U1006.77 40.28,40 40.16,39.88 v1(40.16,39.55)
  Bottom Layer w0.254: H14.10 47.27,46.66 v1(40.16,39.55)
PD9: length 28.2
  Top Layer w0.254: v1(40.66,42.6) 40.47,42.6 39.78,41.9 U1006.78
  Bottom Layer w0.254: H14.9 63.08,47.74 47.84,47.74 42.7,42.6 v1(40.66,42.6)
PD10: length 29.2
  Top Layer w0.254: v1(39.28,39.56) U1006.79
  Bottom Layer w0.254: v1(39.28,39.56) 40.08,40.36 40.08,42.84 46.44,49.2 H14.8
PD11: length 30.3
  Top Layer w0.254: H14.7 63.08,50.28 61.18,50.28 54.84,43.94 40.82,43.94 38.86,41.98 38.86,41.03 U1006.80
PD12: length 28.4
  Top Layer w0.254: H14.6 54.18,44.3 40.67,44.3 38.36,41.99 38.36,41.03 U1006.81
PD13: length 32.3
  Top Layer w0.254: H14.5 63.08,52.82 61.18,52.82 53.01,44.65 40.52,44.65 37.86,41.99 37.86,41.03 U1006.82
PD14: length 50.2
  Top Layer w0.254: U1004.1 5.4,59.32 2.89,56.82 ; v1(35.91,50.47) 30.58,50.47 28.55,52.5 v1(23.72,52.5) ; v1(36.67,47.68) 36.28,47.28 U1006.85
  Bottom Layer w0.254: v1(23.72,52.5) 20.52,55.7 8.84,55.7 6.64,57.9 4.52,57.9 3.44,56.82 2.89,56.82 ; v1(35.91,50.47) 36.26,50.12 36.26,48.09 v1(36.67,47.68)
PD15: length 44.9
  Top Layer w0.254: v1(27.79,46.66) 30.33,44.12 33.69,44.12 35.7,42.11 35.7,41.03 U1006.86 ; U3.1 2.93,59.32 3.61,60 5.98,60 6.14,59.84 6.14,58.81 5.43,58.1 H13.1
  Bottom Layer w0.254: H13.1 7.26,54.99 20.07,54.99 23.67,51.39 23.67,50.77 v1(27.79,46.66)
PE0: length 30.8
  Top Layer w0.254: U1006.141 24,22.9 v1(24.14,23.04)
  Bottom Layer w0.254: 2.89,3.48 3.97,4.56 5.66,4.56 v1(24.14,23.04)
PE1: length 28.1
  Top Layer w0.254: U1006.142 23.85,22.4 v1(24.23,22.02)
  Bottom Layer w0.254: v1(24.23,22.02) 5.69,3.48 H13.43
PE2: length 15.1
  Top Layer w0.254: U1006.1 24.78,11.64 H12.1
PE3: length 17.8
  Top Layer w0.254: U1006.2 25.28,11.2 20.97,6.89 20.97,5.29 H12.2
PE4: length 14.5
  Top Layer w0.254: U1006.3 25.78,10.1 H12.3
PE5: length 17.2
  Top Layer w0.254: H12.4 23.51,5.29 23.51,6.89 26.28,9.66 U1006.4
PE6: length 13.8
  Top Layer w0.254: H12.5 26.78,8.56 U1006.5
PE7: length 19.6
  Top Layer w0.254: U1006.58 56.06,31.9 H14.26
PE8: length 21.3
  Top Layer w0.254: U1006.59 57.28,32.4 59.35,30.33 62.72,30.33 H14.23
PE9: length 19
  Top Layer w0.254: U1006.60 57.6,32.9 v1(59.59,30.91)
  Bottom Layer w0.254: v1(59.59,30.91) H14.24
PE10: length 18.5
  Top Layer w0.254: U1006.63 58.64,34.4 H14.22
PE11: length 21.3
  Top Layer w0.254: U1006.64 59.16,34.9 61.18,32.88 62.7,32.88 H14.21
PE12: length 17.9
  Top Layer w0.254: U1006.65 60.18,35.4 H14.20
PE13: length 20.6
  Top Layer w0.254: H14.19 62.7,35.42 61.18,35.42 60.7,35.9 U1006.66
PE14: length 17.3
  Top Layer w0.254: H14.18 61.52,36.4 U1006.67
PE15: length 20.6
  Top Layer w0.254: H14.17 63.08,37.58 61.18,37.58 60.5,36.9 U1006.68
PF0: length 13.1
  Top Layer w0.254: H12.9 29.28,6.86 U1006.10
PF1: length 16.4
  Top Layer w0.254: U1006.11 29.78,7.96 30.85,6.89 30.85,5.01 H12.10
PF2: length 13.8
  Top Layer w0.254: U1006.12 30.28,8.4 H12.11
PF3: length 17.1
  Top Layer w0.254: H12.12 33.39,5.01 33.39,6.89 30.7,9.58 30.7,19.27 U1006.13
PF4: length 14.5
  Top Layer w0.254: U1006.14 31.2,19.27 31.2,10.02 H12.13
PF5: length 18.4
  Top Layer w0.254: U1006.15 31.7,19.27 31.7,10.02 34.17,7.55 35.26,7.55 35.93,6.89 35.93,5.01 H12.14
PF6: length 20.4
  Top Layer w0.254: v1(33.02,21.02) 33.02,20.57 33.28,20.31 U1006.18
  Bottom Layer w0.254: v1(33.02,21.02) 31.85,19.86 31.85,9.76 33.71,7.91 35.85,7.91 H12.15
PF7: length 31.7
  Top Layer w0.254: v1(33.78,21.16) U1006.19
  Bottom Layer w0.254: H12.16 37.34,2.79 37.37,2.75 40.35,2.75 41.01,3.41 41.01,4.35 40.35,5.01 39.25,5.01 38.47,5.79 38.47,6.89 37.81,7.55 36.87,7.55 36.87,7.54 36.72,7.54 36,8.27 33.91,8.27 32.21,9.97 32.21,19.71 32.94,20.44 33.26,20.44 33.6,20.78 33.6,21.1 33.66,21.16 v1(33.78,21.16)
PF8: length 19.5
  Top Layer w0.254: H12.17 39.75,6.29 39.37,6.29 38.5,7.17 38.19,7.17 37.57,7.78 35.54,7.78 35.41,7.91 34.32,7.91 32.18,10.05 32.18,16.05 34.32,18.19 34.32,19.3 U1006.20
PF9: length 28.5
  Top Layer w0.254: v1(31.37,21.28) 31.38,21.28 31.96,21.86 33.9,21.86 34.36,21.4 34.36,20.91 34.7,20.58 34.7,19.43 U1006.21
  Bottom Layer w0.254: H12.18 38.47,5.29 36.87,5.29 36.21,5.95 36.21,6.61 35.27,7.55 34.33,7.55 34.33,7.54 33.53,7.54 31.5,9.58 31.5,19.31 31.37,19.44 v1(31.37,21.28)
PF10: length 25.1
  Top Layer w0.254: v1(35.28,20.93) U1006.22
  Bottom Layer w0.254: v1(35.28,20.93) 35.18,20.93 32.56,18.31 32.56,10.11 34.05,8.63 36.25,8.63 36.98,7.91 37.95,7.91 38.44,7.42 39.28,7.42 39.41,7.55 41.29,7.55 H12.19
PF11: length 24.3
  Top Layer w0.254: U1006.49 51.42,27.4 61.18,17.64 63.08,17.64 H14.31
PF12: length 21.1
  Top Layer w0.254: U1006.50 52.44,27.9 H14.32
PF13: length 23.2
  Top Layer w0.254: H14.29 62.72,22.71 59.35,22.71 52.66,29.4 U1006.53
PF14: length 20.9
  Top Layer w0.254: v1(59.59,23.29) 52.98,29.9 U1006.54
  Bottom Layer w0.254: v1(59.59,23.29) H14.30
PF15: length 25.8
  Top Layer w0.254: U1006.55 43.38,30.4 43.17,30.61 v1(42.79,30.61)
  Bottom Layer w0.254: v1(42.79,30.61) 55.83,30.61 61.18,25.26 62.7,25.26 H14.27
PG0: length 20.2
  Top Layer w0.254: U1006.56 54.52,30.9 H14.28
PG1: length 22.8
  Top Layer w0.254: U1006.57 55.04,31.4 61.18,25.26 63.08,25.26 H14.25
PG2: length 42.3
  Top Layer w0.254: U1006.87 35.2,41.03 35.2,42.11 33.79,43.51 30.43,43.51 28.04,45.9 8.1,45.9 5.88,48.12 4.99,48.12 4.21,48.9 4.21,49.79 3.34,50.66 2.45,50.66 1.81,51.29 1.81,53.2 2.89,54.28
PG3: length 57.3
  Top Layer w0.254: v1(34.14,39.43) 34.38,39.67 34.45,39.67 34.78,40 U1006.88
  Bottom Layer w0.254: v1(34.14,39.43) 32.49,41.07 30.33,41.07 29.31,42.09 29.31,42.6 28.99,42.91 28.1,42.91 27.28,42.09 26.26,42.09 25.75,42.6 25.75,43.1 28.55,45.9 28.55,49.2 21.69,56.06 8.99,56.06 6.45,58.6 2.89,58.6 1.62,57.33 1.62,56.31 2.39,55.55 4.16,55.55 H13.3
PG4: length 42.3
  Top Layer w0.254: 2.89,51.74 4.35,50.28 5.88,50.28 8.92,47.24 26.19,47.24 26.9,47.96 29,47.96 29.72,47.23 32.55,47.23 ; LED4.4 33.82,48.5 32.55,47.23 ; 32.55,47.23 34.07,45.71 v1(34.07,44.69) ; v1(34.07,42.41) 34.28,42.2 U1006.89
  Bottom Layer w0.254: v1(34.07,42.41) v1(34.07,44.69)
PG5: length 34.8
  Top Layer w0.254: v1(33.12,39.29) 33.78,39.95 U1006.90
  Bottom Layer w0.254: v1(33.12,39.29) 31.85,40.56 16.61,40.56 H13.5
PG6: length 51.6
  Top Layer w0.254: 2.89,49.2 1.81,48.12 1.81,38.59 2.45,37.96 5.88,37.96 8.11,40.19 v1(15.08,40.19) ; U1006.91 33.28,42.16 v1(33.12,42.32)
  Bottom Layer w0.254: v1(33.12,42.32) 33.12,41.27 34.72,39.67 34.72,39.18 33.77,38.23 17.93,38.23 15.98,40.19 v1(15.08,40.19)
PG7: length 69.6
  Top Layer w0.254: v1(37.35,45.9) 37.35,47.93 v1(36.84,48.44) ; v1(19.91,44.12) 20.17,44.37 v1(22.96,44.37) ; v1(35.83,38.66) 32.92,38.66 32.54,39.05 32.54,39.54 32.78,39.78 U1006.92 ; v1(20.93,49.2) 21.54,49.2 23.27,50.93 23.27,52.13 23.14,52.26 23.14,52.74 23.48,53.09 28.47,53.09 30.32,51.23 v1(36.08,51.23)
  Bottom Layer w0.254: v1(36.84,48.44) 36.84,50.47 v1(36.08,51.23) ; H13.7 5.43,50.21 4.35,51.29 4.35,52.19 4.99,52.82 11.21,52.82 v1(19.91,44.12) ; v1(22.96,44.37) 22.96,47.17 v1(20.93,49.2) ; v1(37.35,45.9) 37.35,40.19 v1(35.83,38.66)
PG8: length 33.2
  Top Layer w0.254: 2.89,46.66 4.35,45.2 27.72,45.2 v1(29.82,43.1) ; U1006.93 32.28,42.17 v1(32.1,42.34)
  Bottom Layer w0.254: v1(32.1,42.34) 31.81,42.34 31.48,42.01 30.16,42.01 29.82,42.36 v1(29.82,43.1)
PG9: length 24
  Top Layer w0.254: U1006.124 14.56,31.4 5.88,22.72 4.35,22.72 2.89,21.26
PG10: length 21.3
  Top Layer w0.254: H13.29 15.07,30.9 U1006.125
PG11: length 24.7
  Top Layer w0.254: 2.89,18.72 4.35,20.18 5.88,20.18 16.1,30.4 U1006.126
PG12: length 21.9
  Top Layer w0.254: U1006.127 16.61,29.9 H13.31
PG13: length 25.3
  Top Layer w0.254: 2.89,16.18 4.35,17.64 5.88,17.64 17.64,29.4 U1006.128
PG14: length 22.8
  Top Layer w0.254: U1006.129 17.8,28.9 5.43,16.53 H13.33
PG15: length 25.5
  Top Layer w0.254: U1006.132 18.18,27.4 5.88,15.1 4.35,15.1 2.89,13.64
STLUSBD+: length 16.1
  Top Layer w0.254: v1(18.93,72.57) 18.3,73.2 13.85,73.2 13.51,73.55 12.37,73.55 12.21,73.39 12.21,72.07 12.03,71.89 11.27,71.89 R82.2 9.28,70.03 ; U1007.33 21.1,71.93 21.22,71.81 v1(21.22,71.55)
  Bottom Layer w0.254: v1(18.93,72.57) 20.2,72.57 v1(21.22,71.55)
STLUSBD-: length 7.1
  Top Layer w0.254: 20.07,74.35 19.82,74.35 ; 20.07,74.35 21.09,75.36 R81.2 ; 20.07,74.35 20.58,74.35 21.6,73.33 U1007.32
T_JTCK_SWCLK: length 7.2
  Top Layer w0.254: U1007.15 25.9,66.63 24.6,67.93 U1007.26
T_JTMS_SWDIO: length 1.7
  Top Layer w0.254: U1007.27 24.02,72.71 24.02,74.09 R79.1
T_RXD: length 30.2
  Top Layer w0.254: v1(29.4,68.23) 29.4,67.72 27.3,65.63 U1007.13 ; v1(18.93,75.24) 7.84,75.24 LED7.1
  Bottom Layer w0.254: v1(18.93,75.24) 22.97,75.24 23.44,74.77 23.44,74.18 v1(29.4,68.23)
T_SWDIO_IN: length 1.7
  Top Layer w0.254: U1007.25 25.39,72.92 R79.2
T_TXD: length 31.2
  Top Layer w0.254: v1(25.42,63.11) 25.1,63.43 U1007.12 ; LED5.1 8.23,74.43 7.5,73.7 6.22,73.7
  Bottom Layer w0.254: v1(6.22,73.7) 6.22,73.38 5.09,72.25 5.09,70.02 9.7,65.41 15.12,65.41 16.12,64.41 16.6,64.41 16.75,64.56 22.63,64.56 24.08,63.11 v1(25.42,63.11)
USBRENUMN: length 9
  Top Layer w0.254: R19.1 11.62,67.18 11.7,67.18 13.53,69.01 v1(14.98,69.01) ; v1(16.76,70.79) 16.92,70.63 U1007.38
  Bottom Layer w0.254: v1(14.98,69.01) v1(16.76,70.79)
VREF: length 3.8
  Top Layer w0.254: U1006.32 40.28,20.55 v1(40.45,20.72)
  Bottom Layer w0.254: v1(40.45,20.72) 40.27,20.9 40.25,20.9 40.09,21.06 40.09,21.08 39.56,21.6 38.48,21.6
$1N11988: length 1.9
  Top Layer w0.254: U3.2 R4.1
$1N11998: length 1.9
  Top Layer w0.254: U1004.2 R66.1
$1N12007: length 2.4
  Top Layer w0.254: R3.1 55.45,60.92 U1.2
$1N12170: length 4.8
  Top Layer w0.254: 35.18,53.2 v1(36.19,53.2)
  Bottom Layer w0.254: v1(36.19,53.2) 36.21,53.19 R76.2 39.77,53.19 C39.1
$1N14474: length 3.4
  Top Layer w0.254: v1(20.83,66.23) 20.83,65.53 20.6,65.3 U1007.3
  Bottom Layer w0.254: R77.2 20.83,66.73 v1(20.83,66.23)
$1N14475: length 3.4
  Top Layer w0.254: U1007.2 20.1,65.63 v1(20.19,65.72)
  Bottom Layer w0.254: v1(20.19,65.72) 19.69,66.23 R1.2
$1N14483: length 2.7
  Top Layer w0.254: R26.2 29.33,69.13 U1007.20
$1N14522: length 2.6
  Top Layer w0.254: Q1.2 9.35,68.31 R16.2
$1N14524: length 6.3
  Top Layer w0.254: Q1.1 9.35,66.41 R19.2 R18.2 R17.1
$1N14545: length 3.5
  Top Layer w0.254: 16.11,70.72 16.11,70.97 ; 16.11,70.72 R83.2 ; 16.11,70.72 16.11,70.61 16.59,70.13 U1007.39
$1N14546: length 2.7
  Top Layer w0.254: U1007.44 15.73,67.63 R78.1
$1N14552: length 1.5
  Top Layer w0.254: v1(12.95,72.12) 12.95,72.86 12.94,72.87
  Bottom Layer w0.254: R84.2 v1(12.95,72.12)
$1N14560: length 2.9
  Top Layer w0.254: LED8.2 v1(11.42,73.5)
  Bottom Layer w0.254: v1(11.42,73.5) 11.43,73.49 R85.2
$1N14561: length 5.8
  Top Layer w0.254: LED3.2 9.23,72.01 9.08,72.01 v1(7.73,70.65)
  Bottom Layer w0.254: v1(7.73,70.65) 9.27,70.65 R11.2
$1N14562: length 2.1
  Top Layer w0.254: v1(6.22,72.02) LED7.2
  Bottom Layer w0.254: R23.2 6.83,71.42 v1(6.22,72.02)
$1N14563: length 2.8
  Top Layer w0.254: LED5.2 v1(8.51,73.5)
  Bottom Layer w0.254: R24.2 v1(8.51,73.5)
$1N18116: length 6.6
  Top Layer w0.254: R86.2 43.5,68.68 45.73,68.68 46.84,67.57 47.79,67.57 47.95,67.4 47.95,66.46 USB4.4

## Copper pours and planes (outline as drawn; the poured copper is in the pictures)
GND on Top Layer: -6.67,81.97 70.17,81.97 70.17,-3.63 -6.67,-3.63
GND on Bottom Layer: -6.35,82.22 70.48,82.22 70.48,-3.38 -6.35,-3.38

Small or netless copper shapes (teardrops, artwork), in the pictures only: 1 on Bottom Layer

## Text on the board
Bottom Silkscreen Layer: GND | S.F103.Z6-STL "SS" | V1.1.0 | Prototype 02
Top Silkscreen Layer: BOOT | 3.3'SWIO'SWLCK'G | NRST | WKUP
